# EAGLE design CTS Version 2 (EAGLE 9.1.2)
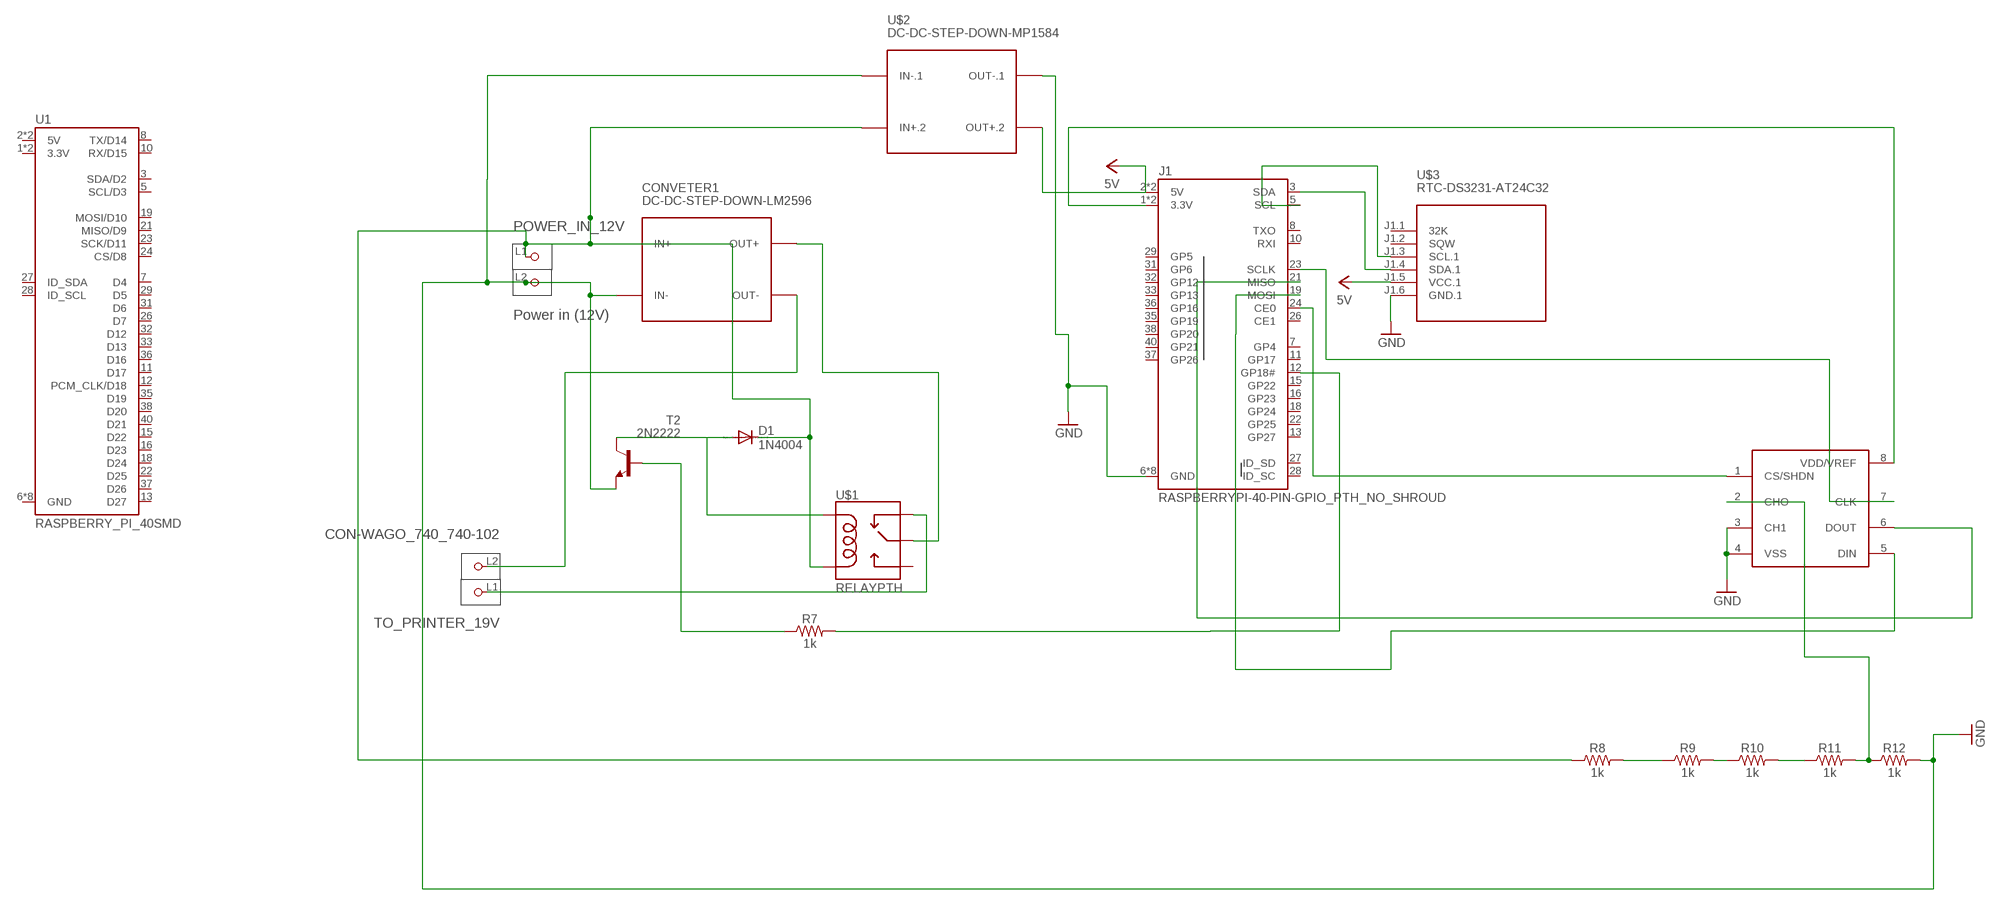
[diagram p0: schematic, sheet 1]

## Parts
CONVETER1  DC-DC-STEP-DOWN-LM2596  [DC-DC-STEP-DOWN-LM2596]
D1  1N4004  [DO41-10]
DPI1  DIP762W53P254L900H508Q8B'  [SOP254P1132X265-8N]
J1  RASPBERRYPI-40-PIN-GPIO_PTH_NO_SHROUD  [2X20]
POWER_IN_12V  Power in (12V)  CON-WAGO_740_740-102  [CON-WAGO_740_P-740-102]
R7  1k  1KOHM-HORIZ-1/4W-5%  [AXIAL-0.3]
R8  1k  1KOHM-HORIZ-1/4W-5%  [AXIAL-0.3]
R9  1k  1KOHM-HORIZ-1/4W-5%  [AXIAL-0.3]
R10  1k  1KOHM-HORIZ-1/4W-5%  [AXIAL-0.3]
R11  1k  1KOHM-HORIZ-1/4W-5%  [AXIAL-0.3]
R12  1k  1KOHM-HORIZ-1/4W-5%  [AXIAL-0.3]
T2  2N2222  [TO92-EBC-OVAL]
TO_PRINTER_19V  CON-WAGO_740_740-102  [CON-WAGO_740_P-740-102]
U1  RASPBERRY_PI_40SMD  [RASPBERRY_PI_SHIELD_HOLES]
U$1  RELAYPTH  [SRD-05VDC-SL-C]
U$2  DC-DC-STEP-DOWN-MP1584  [DC-DC-STEP-DOWN-MP1584]
U$3  RTC-DS3231-AT24C32  [RTC-DS3231-AT24C32]

## Nets
GND [power]: CONVETER1.IN- DPI1.3(CH1) DPI1.4(VSS) J1.6(GND) J1.9(GND) J1.14(GND) J1.20(GND) J1.25(GND) J1.30(GND) J1.34(GND) J1.39(GND) POWER_IN_12V.L2(P2) R12.P$2 T2.E U$2.IN-.1 U$2.OUT-.1 U$3.J1.6(GND.1)
N$1 [power]: CONVETER1.IN+ D1.C POWER_IN_12V.L1(P1) R8.P$1 U$1.COIL0 U$2.IN+.2
N$2: J1.3(SDA) U$3.J1.4(SDA.1)
N$3: DPI1.7(CLK) J1.23(SCLK)
N$4 [power]: CONVETER1.OUT- TO_PRINTER_19V.L2(P2)
N$5: R8.P$2 R9.P$1
N$6: DPI1.6(DOUT) J1.21(MISO)
N$7: J1.12(GP18#) R7.P$2
N$8 [power]: D1.A T2.C U$1.COIL1
N$9: DPI1.5(DIN) J1.19(MOSI)
N$10: DPI1.8(VDD/VREF) J1.1(3.3V) J1.17(3.3V)
N$11 [power]: R7.P$1 T2.B
N$12 [power]: TO_PRINTER_19V.L1(P1) U$1.SWCLOSED(SWCLOSE)
N$13 [power]: CONVETER1.OUT+ U$1.SWCOMMON
N$14: DPI1.1(CS/SHDN) J1.24(CE0)
N$15: R9.P$2 R10.P$1
N$19: DPI1.2(CHO) R11.P$2 R12.P$1
N$20: R10.P$2 R11.P$1
N$50: J1.5(SCL) U$3.J1.3(SCL.1)
VCC [power]: J1.2(5V) J1.4(5V) U$2.OUT+.2 U$3.J1.5(VCC.1) ; supply symbol labelled 5V
Unconnected: J1.7(GP4) J1.8(TXO) J1.10(RXI) J1.11(GP17) J1.13(GP27) J1.15(GP22) J1.16(GP23) J1.18(GP24) J1.22(GP25) J1.26(CE1) J1.27(ID_SD) J1.28(ID_SC) J1.29(GP5) J1.31(GP6) J1.32(GP12) J1.33(GP13) J1.35(GP19) J1.36(GP16) J1.37(GP26) J1.38(GP20) J1.40(GP21) U1.1(3.3V) U1.2(5V) U1.3(SDA/D2) U1.4(5V) U1.5(SCL/D3) U1.6(GND) U1.7(D4) U1.8(TX/D14) U1.9(GND) U1.10(RX/D15) U1.11(D17) U1.12(PCM_CLK/D18) U1.13(D27) U1.14(GND) U1.15(D22) U1.16(D23) U1.17(3.3V) U1.18(D24) U1.19(MOSI/D10) U1.20(GND) U1.21(MISO/D9) U1.22(D25) U1.23(SCK/D11) U1.24(CS/D8) U1.25(GND) U1.26(D7) U1.27(ID_SDA) U1.28(ID_SCL) U1.29(D5) U1.30(GND) U1.31(D6) U1.32(D12) U1.33(D13) U1.34(GND) U1.35(D19) U1.36(D16) U1.37(D26) U1.38(D20) U1.39(GND) U1.40(D21) U$1.SWOPEN U$3.J1.1(32K) U$3.J1.2(SQW)

## Library data of the parts
CONVETER1 = GHIdiy-modules:DC-DC-STEP-DOWN-LM2596: DC/DC Step-Down Regulator based on LM2596-ADJ chip LM2596 datasheet available here: http://www.ti.com/lit/ds/symlink/lm2596.pdf Click here to find device on ebay.com <http://www.ebay.com/sch/lm2596+power+regulator>
D1 = diode:1N4004: DIODE general purpose rectifier, 1 A
DPI1 = GHII MCP 3002:DIP762W53P254L900H508Q8B
J1 = GHIISparkFun-Connectors:RASPBERRYPI-40-PIN-GPIO: Raspberry Pi GPIO Header 2x20 pin connector, as found on B, B+, A+ models. Both shrouded PTH and SMT versions available. SparkFun Products: GPIO Shrouded Header <https://www.sparkfun.com/products/13054>- PTH SparkFun Pi Wedge (Preassembled) <https://www.sparkfun.com/products/13717>
POWER_IN_12V TO_PRINTER_19V = Termnal block:CON-WAGO_740_740-102: Serie 740, Klemmenleiste für Leiterplatten 1 Lötstift/Pol / Series 740, PCB terminal strip 1 solder pin/pole Polzahl / Pole No.: 2 Rastermaß / Pitch: 5 mm Bemessungsspannung / Rated Voltage: 320 V Nennstrom / Nominal Current: 16 A Leiterquerschnitt / Conductor Size: 0.08 - 2.5 mm² Anschlusstechnik / Connection Technology: CAGE CLAMP® Lötstiftlänge: / Solder Pin Length: 5.1 mm Leitereinführung (zur Platine) / Conductor entry angle (to PCB): 0 ° Farbe / Color: grau / gray Stand: 01.01.2012. Die jeweils aktuellen Daten zu diesem Artikel finden Sie in unserem Produktkatalog, den Sie unter www.wago.com einsehen können. As of: 01/01/2012. Please find the newest data for this article in our product catalogue, which can be viewed under www.wago.com.
R7-R12 = SparkFun-Resistors:1KOHM: 1kΩ resistor A resistor is a passive two-terminal electrical component that implements electrical resistance as a circuit element. Resistors act to reduce current flow, and, at the same time, act to lower voltage levels within circuits. - Wikipedia; PROD_ID: RES-08380
T2 = adafruit:2N2222: NPN TRANSISTOR Big oval pads
U1 = SparkFun-Connectors:RASPBERRY_PI_40
U$1 = SRD-Relay:RELAY: SPDT relay (COM-00101)
U$2 = GHIdiy-modulesRTC:DC-DC-STEP-DOWN-MP1584: DC/DC Step-Down Regulator based on MP1584 chip MP1584 datasheet available here: http://www.haoyuelectronics.com/Attachment/MP1584/MP1584.pdf Click here to find device on ebay.com <http://www.ebay.com/sch/mp1584+module>
U$3 = GHIdiy-modulesRTC:RTC-DS3231-AT24C32: RTC Module with Battery and EEPROM based on DS3231 and AT24C32 chips Tutorial can be found here: https://edwardmallon.wordpress.com/2014/05/21/using-a-cheap-3-ds3231-rtc-at24c32-eeprom-from-ebay/ Click here to find device on ebay.com <http://www.ebay.com/sch/DS3231+AT24C32+module>

## Net classes
0 default: width 0.762 mm, drill 0.762 mm, clearance 0.635 mm
1 power: width 1 mm, drill 1 mm, clearance 0.635 mm
2 data: width 0.762 mm, drill 0.762 mm, clearance 0.635 mm

## Board
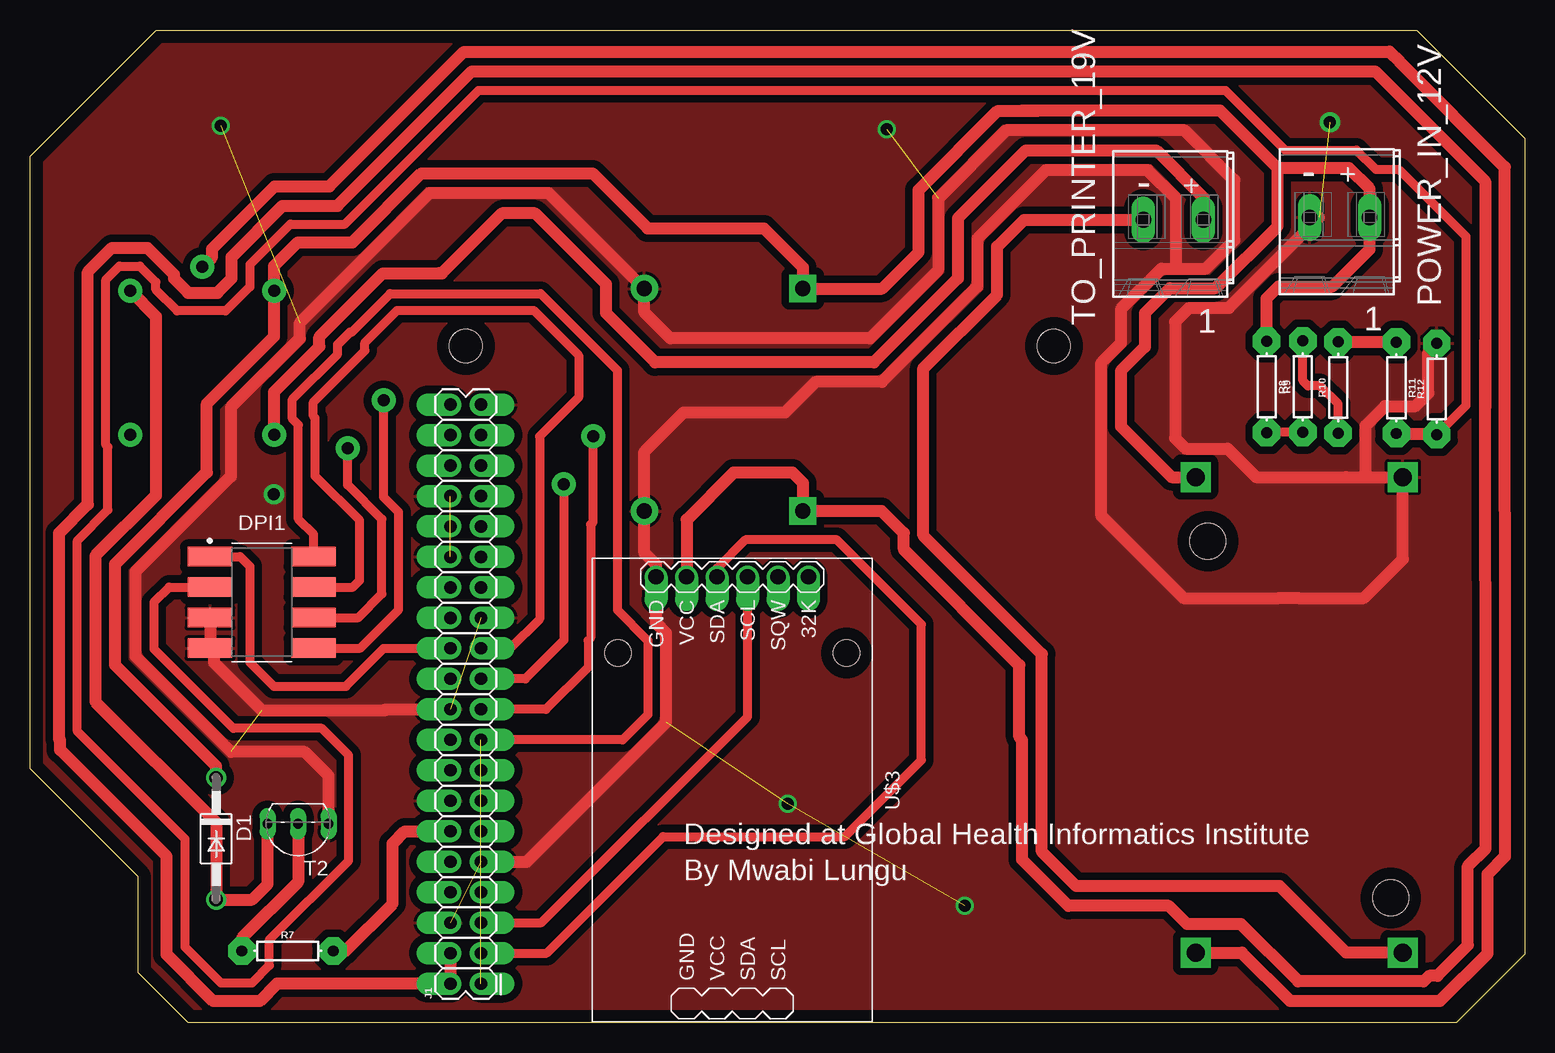
[diagram p1: board, top side]
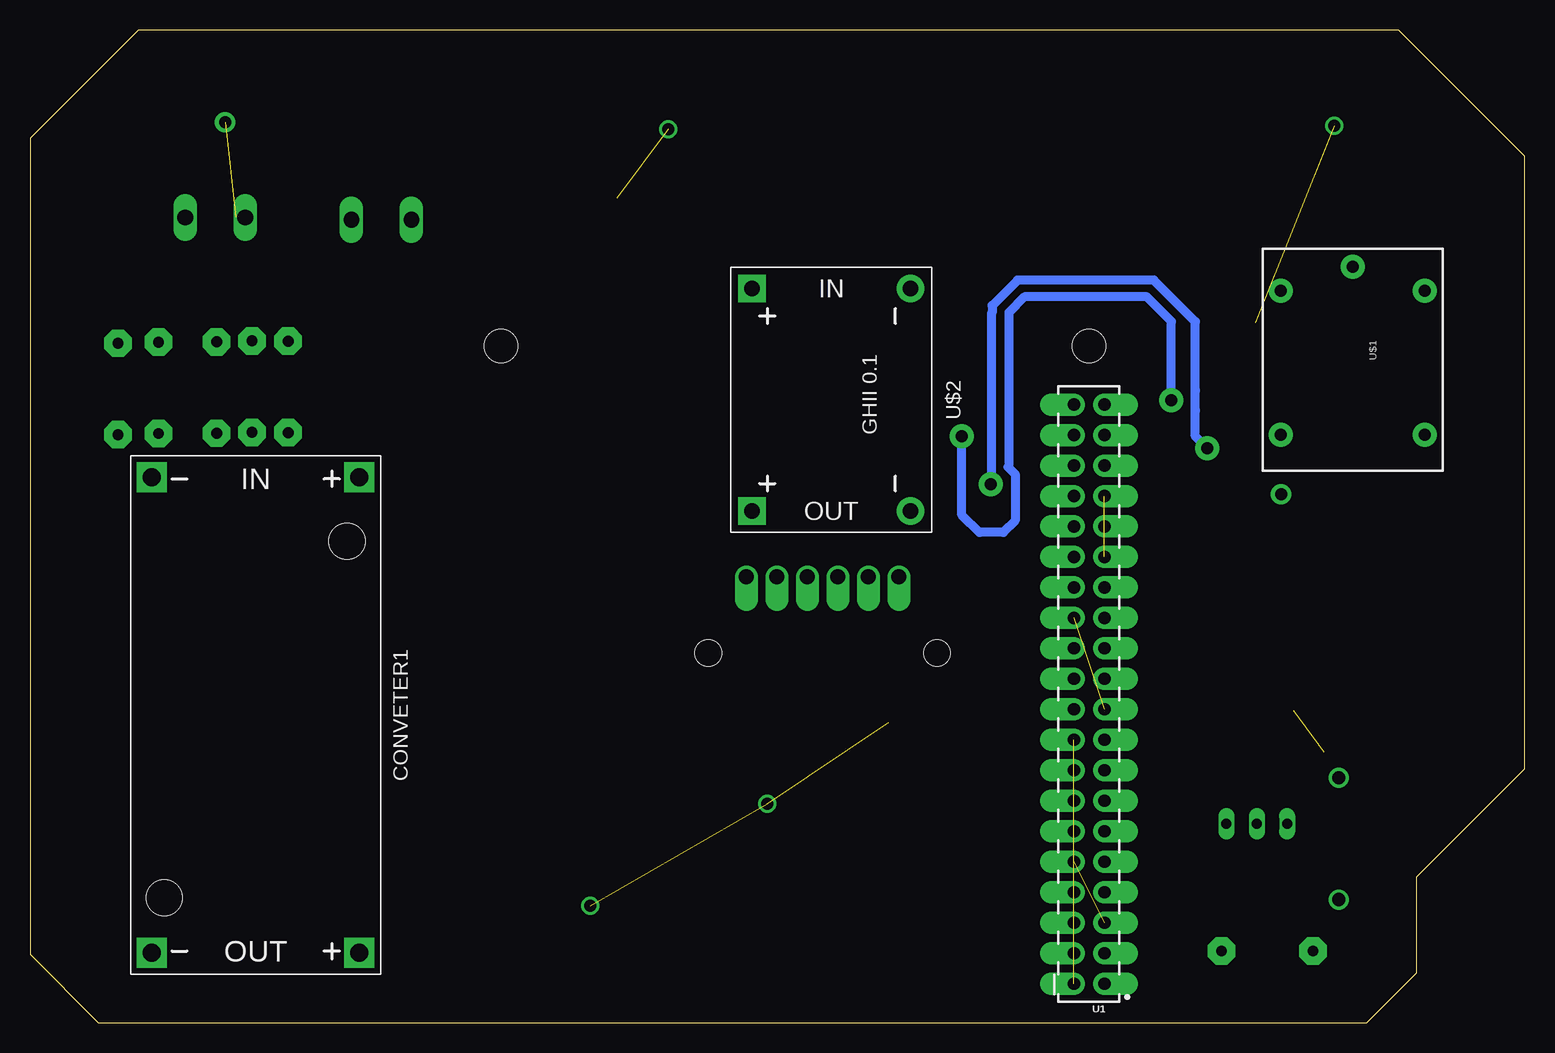
[diagram p2: board, bottom side, seen from below]

Size 124.57 x 82.74 mm. Coordinates in mm from the lower left corner, seen from the top.
Outline: 13,0.19 9,4.19 9,12.19 8,13.19 0,21.19 0,72.23 10.51,82.74 115.56,82.74 124.57,73.73 124.57,5.7 118.87,0 13.19,0 13,0.19
Copper layers (1*16): Top 0.035mm / dielectric 1.5mm / Bottom 0.035mm
Design rules "default": minimum track width 6mil, minimum drill 0.35mm, track to track 6mil, track to pad 6mil, pad to pad 6mil, via to via 6mil, smd to smd 6mil, copper to edge 40mil, drill to drill 6mil, minimum pad ring 10mil, minimum via ring 8mil, stop-mask expansion 4mil, vias tented up to drill 0mil, thermal gap 10mil

### Footprints (pad centres in the part's own frame; a part is rotated, then mirrored left to right if it is on the bottom)
DC-DC-STEP-DOWN-LM2596 = drill 1.5 pad 2.5 square: IN+ -19.812,8.636; IN- -19.812,-8.636; OUT+ 19.812,8.636; OUT- 19.812,-8.636 | hole 3: -14.478,7.62; 15.24,-7.62
DO41-10 = drill 1.118: A 5.08,0; C -5.08,0
SOP254P1132X265-8N = smd 3.735 x 1.627: 1 -4.312,3.81; 2 -4.312,1.27; 3 -4.312,-1.27; 4 -4.312,-3.81; 5 4.312,-3.81; 6 4.312,-1.27; 7 4.312,1.27; 8 4.312,3.81
2X20 = drill 1.016 pad 1.88 offset: 1 0,0; 2 0,2.54; 3 2.54,0; 4 2.54,2.54; 5 5.08,0; 6 5.08,2.54; 7 7.62,0; 8 7.62,2.54; 9 10.16,0; 10 10.16,2.54; 11 12.7,0; 12 12.7,2.54; 13 15.24,0; 14 15.24,2.54; 15 17.78,0; 16 17.78,2.54; 17 20.32,0; 18 20.32,2.54; 19 22.86,0; 20 22.86,2.54; 21 25.4,0; 22 25.4,2.54; 23 27.94,0; 24 27.94,2.54; 25 30.48,0; 26 30.48,2.54; 27 33.02,0; 28 33.02,2.54; 29 35.56,0; 30 35.56,2.54; 31 38.1,0; 32 38.1,2.54; 33 40.64,0; 34 40.64,2.54; 35 43.18,0; 36 43.18,2.54; 37 45.72,0; 38 45.72,2.54; 39 48.26,0; 40 48.26,2.54
CON-WAGO_740_P-740-102 = drill 1.3 long: L1 -0.35,2.5; L2 -0.35,-2.5
AXIAL-0.3 = drill 0.9 pad 2.286 octagon: P$1 -3.81,0; P$2 3.81,0
TO92-EBC-OVAL = drill 0.813 long: B 0,-1.27; C 2.54,-1.27; E -2.54,-1.27
RASPBERRY_PI_SHIELD_HOLES = smd 1.02 x 1.87: 1 8.382,7.686; 2 8.382,1.929; 3 10.922,7.686; 4 10.922,1.929; 5 13.462,7.686; 6 13.462,1.929; 7 16.002,7.686; 8 16.002,1.929; 9 18.542,7.686; 10 18.542,1.929; 11 21.082,7.686; 12 21.082,1.929; 13 23.622,7.686; 14 23.622,1.929; 15 26.162,7.686; 16 26.162,1.929; 17 28.702,7.686; 18 28.702,1.929; 19 31.242,7.686; 20 31.242,1.929; 21 33.782,7.686; 22 33.782,1.929; 23 36.322,7.686; 24 36.322,1.929; 25 38.862,7.686; 26 38.862,1.929; 27 41.402,7.686; 28 41.402,1.929; 29 43.942,7.686; 30 43.942,1.929; 31 46.482,7.686; 32 46.482,1.929; 33 49.022,7.686; 34 49.022,1.929; 35 51.562,7.686; 36 51.562,1.929; 37 54.102,7.686; 38 54.102,1.929; 39 56.642,7.686; 40 56.642,1.929 | hole 2.75: 61.512,4.775; 61.512,53.775
SRD-05VDC-SL-C = drill 1 pad 2: COIL0 -5.39,-6.12; COIL1 -5.39,5.88; SWCLOSED 6.61,-6.12; SWCOMMON -7.39,-0.12; SWOPEN 6.61,5.88
DC-DC-STEP-DOWN-MP1584 = drill 1.27 pad 2.286 square: IN+.2 -9.271,-6.604; OUT+.2 9.271,-6.604 | drill 1.27 pad 2.286: IN-.1 -9.271,6.604; OUT-.1 9.271,6.604
RTC-DS3231-AT24C32 = drill 1.27 pad 1.905 offset: J1.1 -17.78,6.35; J1.2 -17.78,3.81; J1.3 -17.78,1.27; J1.4 -17.78,-1.27; J1.5 -17.78,-3.81; J1.6 -17.78,-6.35 | hole 2.2: -11.43,-9.525; -11.43,9.525

### Placement (x,y rotation side)
CONVETER1  105.77,25.66 270 bottom
D1  15.51,15.35 270 top
DPI1  19.32,35.05 0 top
J1  37.58,3.26 90 top
POWER_IN_12V  109.13,66.77 270 top
R7  21.46,5.99 0 top
R8  103.06,52.99 270 top
R9  106.07,53.02 90 top
R10  109.02,52.94 90 top
R11  113.86,52.92 270 top
R12  117.23,52.82 90 top
T2  22.34,15.32 180 top
TO_PRINTER_19V  95.28,66.57 270 top
U1  31.55,-5.11 90 bottom
U$1  14.23,55.6 270 bottom
U$2  57.79,51.92 270 bottom
U$3  58.52,19.39 270 top

### Tracks (layer width: path | path; a pad name or v marks a point on that pad's centre or on a via)
GND  (via drill 1, 1 pad 1, 1 pad 1.7)  (9 unrouted)
  Top 1: DPI1.4 15.2,31.05 | DPI1.4 14.81,31.05 | DPI1.4 15.32,30.92 15.32,30.05 19.32,26.05 29.55,26.05 29.62,26.12 J1.20 | DPI1.3 DPI1.4 | 52.17,35.65 U$3.J1.6 | U$3.J1.6 52.17,38.19 51.19,39.17 U$2.OUT-.1 51.19,47.59 54.47,50.87 62.92,50.87 65.47,53.41 71,53.41 78.95,61.37 78.95,65.35 84.66,71.06 93.17,71.06 95.47,68.76 95.47,62.85 | 25.01,16.72 T2.E 24.88,20.59 22.88,22.59 16.75,22.59 8.78,30.56 8.78,37.58 16.74,45.53 16.74,51.28 22.48,57.03 22.48,58.34 33.3,69.16 43.2,69.16 51.17,61.2 U$2.IN-.1 51.19,59.21 53.36,57.05 70.01,57.05 75.68,62.72 75.68,68.72 81.33,74.37 96.22,74.37 100.36,70.22 100.36,65.22 97.99,62.85 95.47,62.85 | 94.31,62.85 | 94.31,62.85 95.47,62.85 | POWER_IN_12V.L2 107.44,67.12 99.9,59.58 96.6,59.58 95.43,58.42 95.43,48.73 96.3,47.85 99.79,47.85 102.18,45.47 109.68,45.47 111.3,45.47 | 111.3,45.47 111.3,49.76 112.92,51.38 115.44,51.38 116.52,52.47 116.52,55.92 R12.P$2 | 94.31,62.85 90.91,59.46 90.91,56.64 89.27,55 89.27,42.26 96.14,35.39 104.07,35.39 104.1,35.42 105.66,35.42 105.7,35.39 111.14,35.39 114.41,38.65 CONVETER1.IN- 111.3,45.47 | J1.9 41.38,13.42 53.01,25.06 53.01,32.49 52.17,33.32 U$3.J1.6
  other vias: 71.38,74.48 77.89,9.78 15.89,74.78 20.32,44.05 108.32,75.05 63.15,18.25
  pour Top: -1.88,85.14 -1.88,-2.86 126.12,-2.86 126.12,85.14
N$1
  Top 1: 111.63,65.83 POWER_IN_12V.L1 | 82.69,76.04 84,76.04 | 84,76.04 99.15,76.04 103.97,71.22 | POWER_IN_12V.L1 111.63,69.49 109.91,71.22 103.97,71.22 | D1.C 15.51,21.39 7.09,29.81 7.09,38.23 14.74,45.88 14.74,51.59 20.35,57.2 U$1.COIL0 20.35,63.08 22.32,65.05 26.88,65.05 32.62,70.79 46.88,70.79 51.47,66.2 61.16,66.2 64.4,62.97 U$2.IN+.2 71.01,61.2 74.05,64.24 74.05,69.4 80.65,76 83.96,76 84,76.04 | POWER_IN_12V.L1 111.63,64.46 108.52,61.35 104.03,61.35 103.06,60.38 R8.P$1 | CONVETER1.IN+ 95.14,45.47 90.91,49.7 90.91,54.33 92.91,56.33 92.91,59.14 94.98,61.22 98.79,61.22 103.97,66.4 103.97,71.22
N$2
  Top 0.762: U$3.J1.4 57.25,37.89 59.61,40.24 67.24,40.24 74.28,33.2 74.28,21.89 67.9,15.51 52.76,15.51 43.05,5.8 J1.3
N$3
  Top 0.762: DPI1.7 26.92,36.32 27.46,36.87 27.46,41.87 23.76,45.57 23.76,50.4 23.61,50.55 23.61,51.72 27.92,56.03 27.92,56.69 30.59,59.36 41.98,59.36 45.72,55.62 45.72,52.11 42.47,48.87 42.47,33.65 40.02,31.2 J1.23
N$4
  Top 1: CONVETER1.OUT- 109.68,5.84 104.14,11.39 87.2,11.39 84.32,14.27 84.32,30.74 74.45,40.6 74.45,54.55 80.59,60.69 80.59,64.68 82.83,66.92 TO_PRINTER_19V.L2
N$5
  Top 0.762: R9.P$1 103.09,49.21 R8.P$2
N$6  (via drill 1 pad 2)
  Top 0.762: DPI1.6 27.36,33.78 29.33,35.74 29.33,41.98 26.46,44.84 v26.46,47.87 | J1.21 41.27,28.66 44.49,31.89 v44.49,44.89
  Bottom 0.762: v26.46,47.87 27.46,48.87 27.46,51.01 27.45,51.03 27.45,52.7 27.46,52.72 27.46,58.44 30.92,61.89 42.28,61.89 44.4,59.77 44.4,59.19 44.47,59.12 44.47,45.74 44.4,45.67 44.4,44.99 v44.49,44.89
N$7
  Top 1: J1.12 31.23,15.96 30.21,14.94 30.21,9.93 26.27,5.99 R7.P$2
N$8
  Top 1: T2.C 19.8,11.56 18.51,10.27 D1.A 15.51,16.72 5.46,26.78 5.46,38.91 10.48,43.94 10.48,58.85 U$1.COIL1
N$9  (via drill 1 pad 2)
  Top 0.762: DPI1.5 27.53,31.24 30.72,34.43 30.72,42.56 29.46,43.82 v29.46,51.87 | v46.92,48.9 46.92,41.73 46.72,41.53 46.72,32.08 46.5,31.86 46.5,29.64 42.99,26.12 J1.19
  Bottom 0.762: v29.46,51.87 29.46,58.46 31.49,60.49 41.7,60.49 43,59.19 43,46.39 43.07,46.32 42.48,45.73 42.48,41.85 43.47,40.87 45.47,40.87 46.91,42.31 46.91,48.89 v46.92,48.9
N$10  (1 unrouted)
  Top 0.762: 39.78,23.58 J1.17 49.4,23.58 51.5,25.68 51.5,31.86 48.94,34.41 48.94,54.38 42.55,60.76 30.01,60.76 26.84,57.59 26.74,57.59 | 25.79,56.64 26.74,57.59 | DPI1.8 23.63,40.7 22.36,41.97 22.36,49.82 21.86,50.32 21.86,51.95 25.63,55.72 25.63,56.54 26.68,57.59 26.74,57.59
N$11
  Top 1: T2.B 22.34,11.72 17.65,7.04 R7.P$1
N$12
  Top 1: 34.32,62.46 33.97,62.46 | 34.32,62.46 29.41,62.46 24.12,57.17 24.12,56.35 20.35,52.58 U$1.SWCLOSED | TO_PRINTER_19V.L1 97.78,68.76 93.83,72.71 82.98,72.71 77.32,67.05 77.32,62.05 70.32,55.05 52.1,55.05 48,59.15 48,61.56 42.1,67.46 39.32,67.46 34.32,62.46
N$13
  Top 1: CONVETER1.OUT+ 100.99,5.84 105.01,1.82 117.49,1.82 121.47,5.8 121.47,12.4 122.93,13.87 122.91,71.3 114.42,79.79 114.18,80.03 | 114.18,80.03 113.27,80.94 | U$1.SWCOMMON 15.17,63.81 15.17,64.5 20.39,69.71 24.94,69.71 36.15,80.92 113.29,80.92 114.18,80.03
N$14
  Top 0.762: DPI1.1 17.51,38.86 18.32,38.05 18.32,30.05 20.32,28.05 26.32,28.05 29.48,31.2 J1.24
N$15
  Top 0.762: R10.P$1 109.02,51.57 107.5,53.09 106.5,53.09 106.07,53.52 R9.P$2
N$19
  Top 0.762: DPI1.2 11.59,36.32 10.32,35.05 10.32,31.16 16.95,24.53 24.32,24.53 26.56,22.29 26.56,13.53 19.96,6.93 19.96,4.78 18.5,3.33 15.91,3.33 12.91,6.33 12.91,15.33 3.94,24.29 3.94,40.19 6.49,42.74 6.49,48 6.33,48.15 6.33,61.94 7.45,63.06 9.15,63.06 10.48,61.74 10.48,61.1 12.26,59.33 16.31,59.33 18.32,61.33 18.32,63.19 21.69,66.56 26.25,66.56 37.4,77.71 99.62,77.71 104.6,72.73 110.54,72.73 112.18,71.09 114.1,71.09 119.68,65.51 119.68,51.46 R12.P$1
  Top 1: 117.25,48.99 R12.P$1 117.14,49.11 R11.P$2
N$20
  Top 1: R10.P$2 113.84,56.75 R11.P$1
N$50
  Top 0.762: U$3.J1.3 59.79,25.52 42.62,8.34 J1.5
VCC
  Top 1: J1.4 35.01,5.78 35.01,3.29 J1.2 20.58,3.26 19.13,1.81 15.28,1.81 11.39,5.7 11.39,13.88 2.52,22.75 2.52,23.57 2.42,23.67 2.42,40.82 4.82,43.21 4.82,62.57 6.82,64.58 9.78,64.58 12,62.36 12,62.03 13.19,60.84 15.61,60.84 16.8,62.04 16.8,63.82 21.06,68.08 25.62,68.08 36.83,79.29 112.1,79.29 121.26,70.12 121.26,56.82 | U$3.J1.5 54.71,41.94 58.62,45.85 63.55,45.85 64.4,45 U$2.OUT+.2 70.98,42.65 72.81,40.82 72.81,39.45 82.45,29.82 82.45,23.82 82.68,23.58 82.68,13.59 86.52,9.75 94.89,9.75 96.42,8.23 100.92,8.23 105.69,3.46 116.13,3.46 116.58,3.91 117.27,3.91 119.83,6.47 119.83,13.08 121.29,14.54 121.29,16.82 121.28,56.82 121.26,56.82 | 121.26,56.82 121.26,51.23 | 121.26,56.82

### Text on the board
tNames: - | + | - | + | Designed at Global Health Informatics Institute | By Mwabi Lungu